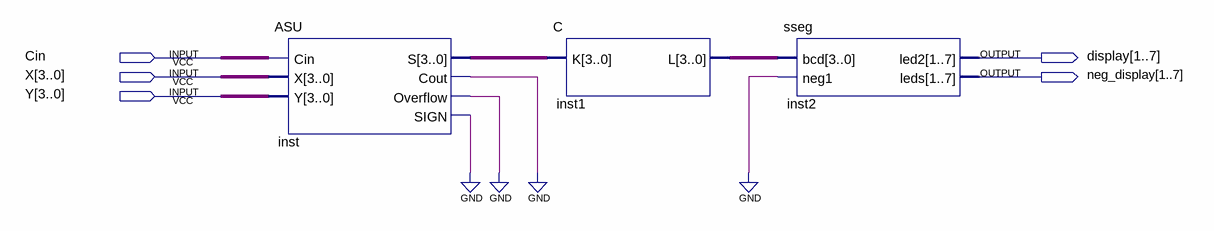
[diagram p0: schematic sheet]
// Quartus schematic CombinedASU2.bdf as structural Verilog: 3 symbols, 5 pins
module CombinedASU2 (
  input  Cin,
  input  [3:0] X,
  input  [3:0] Y,
  output [1:7] display,
  output [1:7] neg_display
);

  wire inst_cout, inst_overflow, inst_sign;
  wire [3:0] inst1_l, inst_s;

  ASU inst (.Cin(Cin), .X(X), .Y(Y), .S(inst_s), .Cout(inst_cout), .Overflow(inst_overflow), .SIGN(inst_sign));
  C inst1 (.K(inst_s), .L(inst1_l));
  sseg inst2 (.bcd(inst1_l), .neg1(1'b0), .led2(display), .leds(neg_display));
  // also tied to GND on the sheet: {inst_cout, inst_overflow, inst_sign}
endmodule
